# Altium schematic sheet FOTA.SchDoc
size A3
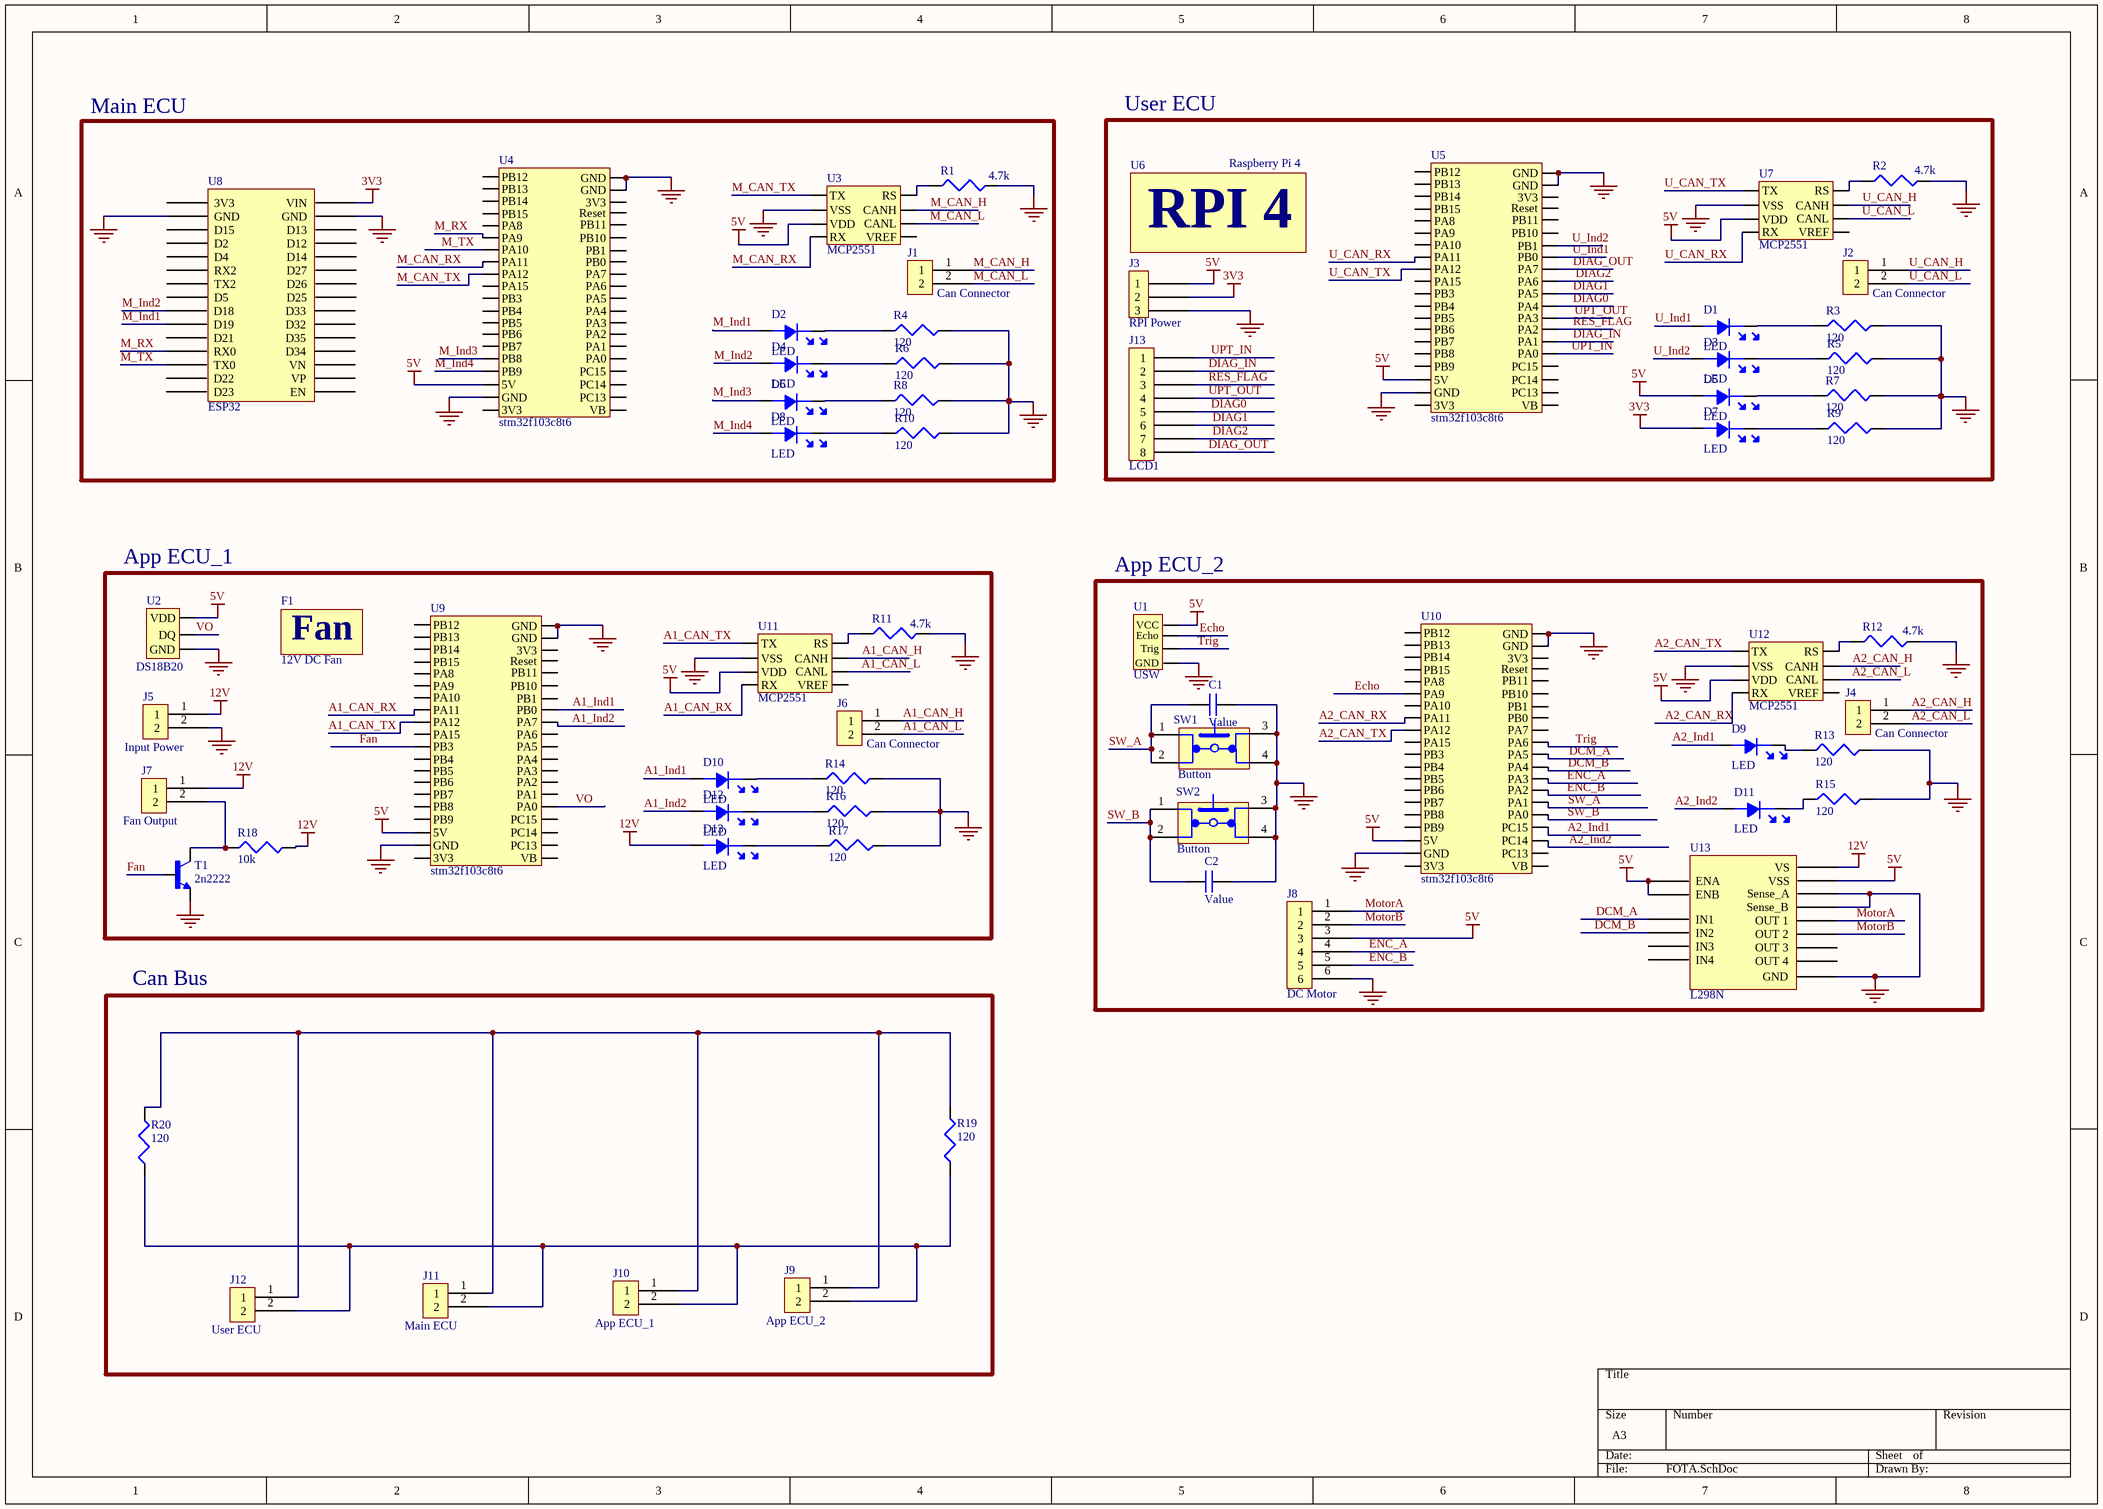
[diagram p0: FOTA.SchDoc]

## Parts
C1  Value  [CAP non]
C2  Value  [CAP non]
D1  LED  [LED]
D2  LED  [LED]
D3  LED  [LED]
D4  LED  [LED]
D5  LED  [LED]
D6  LED  [LED]
D7  LED  [LED]
D8  LED  [LED]
D9  LED  [LED]
D10  LED  [LED]
D11  LED  [LED]
D12  LED  [LED]
D13  LED  [LED]
F1  12V DC Fan
J1  Can Connector  [Data Connnector 2 pins]
J2  Can Connector  [Data Connnector 2 pins]
J3  RPI Power  [Data Connnector 3 pins]
J4  Can Connector  [Data Connnector 2 pins]
J5  Input Power  [Data Connnector 2 pins]
J6  Can Connector  [Data Connnector 2 pins]
J7  Fan Output  [Data Connnector 2 pins]
J8  DC Motor  [Data Connnector 6 pins]
J9  App ECU_2  [Data Connnector 2 pins]
J10  App ECU_1  [Data Connnector 2 pins]
J11  Main ECU  [Data Connnector 2 pins]
J12  User ECU  [Data Connnector 2 pins]
J13  LCD1  [Data Connector 8 pins]
R1  4.7k  [4.7k]
R2  4.7k  [4.7k]
R3  120  [R120]
R4  120  [R120]
R5  120  [R120]
R6  120  [R120]
R7  120  [R120]
R8  120  [R120]
R9  120  [R120]
R10  120  [R120]
R11  4.7k  [4.7k]
R12  4.7k  [4.7k]
R13  120  [R120]
R14  120  [R120]
R15  120  [R120]
R16  120  [R120]
R17  120  [R120]
R18  10k  [10k]
R19  120  [R120]
R20  120  [R120]
SW1  Button  [DIP4 SW]
SW2  Button  [DIP4 SW]
T1  2n2222  [TRANS]
U1  USW  [hc-sr04]
U2  DS18B20  [tmp]
U3  MCP2551  [MCP2551]
U4  stm32f103c8t6  [DIP46]
U5  stm32f103c8t6  [DIP46]
U6  Raspberry Pi 4  [RPI4]
U7  MCP2551  [MCP2551]
U8  ESP32  [ESP32]
U9  stm32f103c8t6  [DIP46]
U10  stm32f103c8t6  [DIP46]
U11  MCP2551  [MCP2551]
U12  MCP2551  [MCP2551]
U13  L298N  [L298]

## Blocks framed on the sheet
Main ECU: D2 D4 D6 D8 J1 R1 R4 R6 R8 R10 U3 U4 U8
User ECU: D1 D3 D5 D7 J2 J3 J13 R2 R3 R5 R7 R9 U5-U7
App ECU_1: D10 D12 D13 F1 J5-J7 R11 R14 R16-R18 T1 U2 U9 U11
App ECU_2: C1 C2 D9 D11 J4 J8 R12 R13 R15 SW1 SW2 U1 U10 U12 U13
Can Bus: J9-J12 R19 R20

## Nets
3V3: D7.1 J3.2 U8.30(VIN)
5V: D5.1 J3.1 J8.3 U1.1(VCC) U2.1(VDD) U3.3(VDD) U4.44(5V) U5.44(5V) U7.3(VDD) U9.44(5V) U10.44(5V) U11.3(VDD) U12.3(VDD) U13.9(ENB) U13.10(ENA) U13.13(VSS)
12V: D13.1 J5.1 J7.1 R18.1 U13.14(VS)
GND: C1.2 C2.2 J3.3 J5.2 J8.6 R1.1 R2.1 R3.1 R4.1 R5.1 R6.1 R7.1 R8.1 R9.1 R10.1 R11.1 R12.1 R13.1 R14.1 R15.1 R16.1 R17.1 SW1.3 SW1.4 SW2.3 SW2.4 T1.1(E) U1.4(GND) U2.3(GND) U3.2(VSS) U4.19(GND) U4.20(GND) U4.45(GND) U5.19(GND) U5.20(GND) U5.45(GND) U7.2(VSS) U8.2(GND) U8.29(GND) U9.19(GND) U9.20(GND) U9.45(GND) U10.19(GND) U10.20(GND) U10.45(GND) U11.2(VSS) U12.2(VSS) U13.11(Sense_B) U13.12(Sense_A) U13.15(GND)
A1_CAN_H: J6.1 U11.7(CANH)
A1_CAN_L: J6.2 U11.6(CANL)
A1_CAN_RX: U9.34(PA11) U11.4(RX)
A1_CAN_TX: U9.35(PA12) U11.1(TX)
A1_Ind1: D10.1 U9.13(PB0)
A1_Ind2: D12.1 U9.12(PA7)
A2_CAN_H: J4.1 U12.7(CANH)
A2_CAN_L: J4.2 U12.6(CANL)
A2_CAN_RX: U10.34(PA11) U12.4(RX)
A2_CAN_TX: U10.35(PA12) U12.1(TX)
A2_Ind1: D9.1 U10.4(PC15)
A2_Ind2: D11.1 U10.3(PC14)
DCM_A: U10.10(PA5) U13.8(IN1)
DCM_B: U10.9(PA4) U13.7(IN2)
DIAG0: J13.5 U5.9(PA4)
DIAG1: J13.6 U5.10(PA5)
DIAG2: J13.7 U5.11(PA6)
DIAG_IN: J13.2 U5.6(PA1)
DIAG_OUT: J13.8 U5.12(PA7)
Echo: U1.3(Echo) U10.32(PA9)
ENC_A: J8.4 U10.8(PA3)
ENC_B: J8.5 U10.7(PA2)
Fan: T1.2(B) U9.37(PB3)
M_CAN_H: J1.1 U3.7(CANH)
M_CAN_L: J1.2 U3.6(CANL)
M_CAN_RX: U3.4(RX) U4.34(PA11)
M_CAN_TX: U3.1(TX) U4.35(PA12)
M_Ind1: D2.1 U8.10(D19)
M_Ind2: D4.1 U8.9(D18)
M_Ind3: D6.1 U4.42(PB8)
M_Ind4: D8.1 U4.43(PB9)
M_RX: U4.32(PA9) U8.12(RX0)
M_TX: U4.33(PA10) U8.13(TX0)
MotorA: J8.1 U13.4(OUT_1)
MotorB: J8.2 U13.3(OUT_2)
RES_FLAG: J13.3 U5.7(PA2)
SW_A: C1.1 SW1.1 SW1.2 U10.6(PA1)
SW_B: C2.1 SW2.1 SW2.2 U10.5(PA0)
Trig: U1.2(Trig) U10.11(PA6)
U_CAN_H: J2.1 U7.7(CANH)
U_CAN_L: J2.2 U7.6(CANL)
U_CAN_RX: U5.34(PA11) U7.4(RX)
U_CAN_TX: U5.35(PA12) U7.1(TX)
U_Ind1: D1.1 U5.13(PB0)
U_Ind2: D3.1 U5.14(PB1)
UPT_IN: J13.1 U5.5(PA0)
UPT_OUT: J13.4 U5.8(PA3)
VO: U2.2(DQ) U9.5(PA0)
NetD1_2: D1.2 R3.2
NetD2_2: D2.2 R4.2
NetD3_2: D3.2 R5.2
NetD4_2: D4.2 R6.2
NetD5_2: D5.2 R7.2
NetD6_2: D6.2 R8.2
NetD7_2: D7.2 R9.2
NetD8_2: D8.2 R10.2
NetD9_2: D9.2 R13.2
NetD10_2: D10.2 R14.2
NetD11_2: D11.2 R15.2
NetD12_2: D12.2 R16.2
NetD13_2: D13.2 R17.2
NetJ7_2: J7.2 R18.2 T1.3(C)
NetJ9_1: J9.1 J10.1 J11.1 J12.1 R19.1 R20.1
NetJ9_2: J9.2 J10.2 J11.2 J12.2 R19.2 R20.2
NetR1_2: R1.2 U3.8(RS)
NetR2_2: R2.2 U7.8(RS)
NetR11_2: R11.2 U11.8(RS)
NetR12_2: R12.2 U12.8(RS)

Not connected (* = marked no-connect by the designer): U3 5(VREF); U4 1(VB) 2(PC13) 3(PC14) 4(PC15) 5(PA0) 6(PA1) 7(PA2) 8(PA3) 9(PA4) 10(PA5) 11(PA6) 12(PA7) 13(PB0) 14(PB1) 15(PB10) 16(PB11) 17(Reset) 18(3V3) 27(PB12) 28(PB13) 29(PB14) 30(PB15) 31(PA8) 36(PA15) 37(PB3) 38(PB4) 39(PB5) 40(PB6) 41(PB7) 46(3V3); U5 1(VB) 2(PC13) 3(PC14) 4(PC15) 15(PB10) 16(PB11) 17(Reset) 18(3V3) 27(PB12) 28(PB13) 29(PB14) 30(PB15) 31(PA8) 32(PA9) 33(PA10) 36(PA15) 37(PB3) 38(PB4) 39(PB5) 40(PB6) 41(PB7) 42(PB8) 43(PB9) 46(3V3); U7 5(VREF); U8 1(3V3) 3(D15) 4(D2) 5(D4) 6(RX2) 7(TX2) 8(D5) 11(D21) 14(D22) 15(D23) 16(EN) 17(VP) 18(VN) 19(D34) 20(D35) 21(D32) 22(D33) 23(D25) 24(D26) 25(D27) 26(D14) 27(D12) 28(D13); U9 1(VB) 2(PC13) 3(PC14) 4(PC15) 6(PA1) 7(PA2) 8(PA3) 9(PA4) 10(PA5) 11(PA6) 14(PB1) 15(PB10) 16(PB11) 17(Reset) 18(3V3) 27(PB12) 28(PB13) 29(PB14) 30(PB15) 31(PA8) 32(PA9) 33(PA10) 36(PA15) 38(PB4) 39(PB5) 40(PB6) 41(PB7) 42(PB8) 43(PB9) 46(3V3); U10 1(VB) 2(PC13) 12(PA7) 13(PB0) 14(PB1) 15(PB10) 16(PB11) 17(Reset) 18(3V3) 27(PB12) 28(PB13) 29(PB14) 30(PB15) 31(PA8) 33(PA10) 36(PA15) 37(PB3) 38(PB4) 39(PB5) 40(PB6) 41(PB7) 42(PB8) 43(PB9) 46(3V3); U11 5(VREF); U12 5(VREF); U13 1(OUT_4) 2(OUT_3) 5(IN4) 6(IN3)

## Notes on the sheet
- (in symbol Raspberry Pi 4) RPI 4

## Library data of the parts
C1 C2 = Non polarized capacitor: Generial Non polarized capacitor for through hole or SMD capacitors
D1-D13 = LED: Led, Red, T-1 (3Mm), 630 Nm, 1.8 V, 30 Ma, 20 Mcd Rohs Compliant: Yes; Manufacturer 1: Wurth Electronics; Manufacturer Part Number 1: 151031SS06000; Wavelength: 630nm; Luminous Intensity: 35mcd; Viewing Angle: 60°; Forward Voltage: 2.2V; Lens Style: Diffused,Circular,Round; Dominant Wavelength: 640nm; Test Current: 20mA; Forward Current: 30mA; Supplier 1: Digi-Key; Stock 1: 4849; Pricing 1: 1=0.18000, 50=0.16700, 100=0.14300, 500=0.12300 (USD); RoHS: Yes; Mount: Through Hole; Case/Package: Radial; Color: Red; Min Operating Temperature: -40°C; Max Operating Temperature: 85°C; Package Quantity: 1; Packaging: Bulk; Height: 5.55mm; Lens Size: 3mm; REACH SVHC: Unknown; RoHS Compliant: Yes; ComponentLink1URL: https://datasheet.ciiva.com/22657/151031ss06000-22657010.pdf?src-supplier=Element14; ComponentLink1Description: https://datasheet.ciiva.com/22657/151031ss06000-22657010.pdf?src-supplier=Element14; ComponentLink2URL: https://datasheet.ciiva.com/29335/759483-da-01-en-tht-led-3mm-superrot-151031ss06000-29335440.pdf?src-supplier=Conrad; ComponentLink2Description: https://datasheet.ciiva.com/29335/759483-da-01-en-tht-led-3mm-superrot-151031ss06000-29335440.pdf?src-supplier=Conrad; ComponentLink3URL: https://datasheet.ciiva.com/29562/151031ss06000-29562907.pdf?src-supplier=Digi-Key; ComponentLink3Description: https://datasheet.ciiva.com/29562/151031ss06000-29562907.pdf?src-supplier=Digi-Key; Supplier Part Number 1: 732-5006-ND; Category: Optoelectronics
F1 = Fan
J1 J2 J4-J7 J9-J12 = Data Connector 2 pins
J3 = Data Connector 3 pin
J8 = Data Connector 6 pin
J13 = Data Connector 8 pins
R1 R2 R11 R12 = R 4K7: Res Carbon Film 4.7K Ohm 5% 1/4W -500ppm/°C to 350ppm/°C Conformal AXL Thru-Hole Paper T/R; Manufacturer 1: Yageo; Manufacturer Part Number 1: CFR-25JR-52-4K7; Resistance: 4.7kR; Max Power Dissipation: 250mW; Voltage Rating: 250V; Lead Diameter: 0.55mm; Supplier 1: Digi-Key; Stock 1: 115000; Pricing 1: 5000=0.00884, 10000=0.00793, 25000=0.00728, 50000=0.00684, 125000=0.00668 (USD); RoHS: Yes; Mount: Through Hole; Case/Package: Axial; Contact Plating: Tin,Matte; Min Operating Temperature: -55°C; Max Operating Temperature: 155°C; Tolerance: 5%; Packaging: Tape and Reel; Package Quantity: 5000; Resistor Type: Carbon Film; Temperature Coefficient: 350ppm/°C; Number of Terminations: 2; Series: CFR; Power Rating: 250mW; Termination: Axial; Diameter: 2.4mm; Length: 6.3mm; Radiation Hardening: No; RoHS Compliant: Yes; Lead Free: Lead Free; ComponentLink1URL: http://www.mouser.com/ds/2/447/Yageo%20LR_CFR_2013-540723.pdf?src-supplier=Mouser; ComponentLink1Description: http://www.mouser.com/ds/2/447/Yageo%20LR_CFR_2013-540723.pdf?src-supplier=Mouser; ComponentLink2URL: http://www.yageo.com/NewPortal/yageodocoutput?fileName=/pdf/throughhole/Yageo_LR_CFR_2013.pdf&src-supplier=Digi-Key; ComponentLink2Description: http://www.yageo.com/NewPortal/yageodocoutput?fileName=/pdf/throughhole/Yageo_LR_CFR_2013.pdf&src-supplier=Digi-Key; ComponentLink3URL: http://www.yageo.com/documents/recent/General%20Type_CFR.pdf?src-supplier=Future+Electronics; ComponentLink3Description: http://www.yageo.com/documents/recent/General%20Type_CFR.pdf?src-supplier=Future+Electronics; ComponentLink4URL: http://www.yageo.com/documents/recent/Yageo%20LR_CFR_2013.pdf?src-supplier=Avnet; ComponentLink4Description: http://www.yageo.com/documents/recent/Yageo%20LR_CFR_2013.pdf?src-supplier=Avnet; Supplier Part Number 1: 4.7KQTR-ND; Category: Resistors
R3-R10 R13-R17 = R120: General Type Carbon Film Resistor 120Ohm 1/4W 5% Axial Bulk; Manufacturer 1: Yageo; Manufacturer Part Number 1: CFR-25JB-52-120R; Resistance: 120R; Power Rating: 250mW; Temperature Coefficient: 500ppm/°C; Supplier 1: Future Electronics; Stock 1: 7000; Pricing 1: 10000=0.00860, 30000=0.00580, 50000=0.00570, 100000=0.00550, 200000=0.00540 (USD); RoHS: Yes; Case/Package: Axial; Min Operating Temperature: -55°C; Max Operating Temperature: 155°C; Tolerance: 5%; Package Quantity: 200; Packaging: Bulk; Resistor Type: Carbon Film; Number of Terminations: 2; Max Power Dissipation: 250mW; Series: Carbon Film; Length: 0.248inch; Lead Free: Lead Free; RoHS Compliant: Yes; ComponentLink1URL: http://www.yageo.com/documents/recent/General%20Type_CFR.pdf?src-supplier=Future+Electronics; ComponentLink1Description: http://www.yageo.com/documents/recent/General%20Type_CFR.pdf?src-supplier=Future+Electronics; ComponentLink2URL: http://www.yageo.com/NewPortal/yageodocoutput?fileName=/pdf/throughhole/Yageo_LR_CFR_2013.pdf&src-supplier=Digi-Key; ComponentLink2Description: http://www.yageo.com/NewPortal/yageodocoutput?fileName=/pdf/throughhole/Yageo_LR_CFR_2013.pdf&src-supplier=Digi-Key; Supplier Part Number 1: 9005903
R18 = R 10K: Through Hole Carbon Film Resistor, Cfr Series, 10 Kohm, 250 Mw, - 5%, 200 V, Axial Leaded; Manufacturer 1: TE Connectivity; Manufacturer Part Number 1: CFR16J10K; Supplier 1: Avnet; Stock 1: 10000; Pricing 1: 10000=0.00819 (USD); RoHS: Yes; ComponentLink1URL: https://datasheet.ciiva.com/11823/0900766b80098b49-11823186.pdf?src-supplier=RSComponents; ComponentLink1Description: https://datasheet.ciiva.com/11823/0900766b80098b49-11823186.pdf?src-supplier=RSComponents; ComponentLink2URL: https://datasheet.ciiva.com/12362/eng-ds-1773195-d-12362991.pdf?src-supplier=Mouser; ComponentLink2Description: https://datasheet.ciiva.com/12362/eng-ds-1773195-d-12362991.pdf?src-supplier=Mouser; Supplier Part Number 1: 1623927-4
R19 R20 = R120_TH
SW1 SW2 = Push Button
U1 = HC-SR04: Ultrasonic Sensor Module, Rectangular, 20-4000 mm, 5 V, 15 mA, Arduino Compatible; Manufacturer 1: OSEPP; Supplier 1: Mouser; Manufacturer Part Number 1: HC-SR04; Stock 1: 154; Pricing 1: 1=6.55000, 10=6.55000, 50=6.55000, 100=6.55000, 1000=6.55000, 10000=6.55000 (USD); ComponentLink1URL: http://www.alliedelec.com/m/d/24ef524bf2e055bb41c3e7d4403161f4.pdf?src-supplier=Allied+Electronics; ComponentLink1Description: http://www.alliedelec.com/m/d/24ef524bf2e055bb41c3e7d4403161f4.pdf?src-supplier=Allied+Electronics; ComponentLink2URL: https://datasheet.octopart.com/HC-SR04-OSEPP-datasheet-46721640.pdf?src-supplier=Allied+Electronics; ComponentLink2Description: https://datasheet.octopart.com/HC-SR04-OSEPP-datasheet-46721640.pdf?src-supplier=Allied+Electronics; Supplier Part Number 1: 375-HC-SR04; Category: Development Boards, Kits, Programmers
U2 = DS18B20: SENSOR TEMPERATURE 1-WIRE TO92-3; Manufacturer 1: Maxim; Manufacturer Part Number 1: DS18B20+; Min Supply Voltage: 3V; Max Supply Voltage: 5.5V; Interface: 1-WIRE,Serial; Resolution: 12b; Output Type: Digital,Voltage; Operating Supply Current: 1.5mA; Number of Bits: 12; Nominal Supply Current: 1mA; Output Current: 4mA; Supplier 1: Future Electronics; Stock 1: 0; Pricing 1: 1=5.05000, 10=4.56000, 25=4.38000, 75=4.17000, 150=4.04000 (USD); RoHS: Yes; Mount: PCB,Through Hole; Case/Package: TO-92-3; Number of Pins: 3; Weight: 0.001lb; Min Operating Temperature: -55°C; Max Operating Temperature: 125°C; Packaging: Rail/Tube; Package Quantity: 10; Series: DS18B20; Max Supply Voltage (DC): 5.5V; Min Supply Voltage (DC): 3V; Termination: SMD/SMT; Supply Current: 1mA; Sensor Type: Temperature; Length: 4.95mm; Width: 3.94mm; Height: 4.95mm; Radiation Hardening: No; RoHS Compliant: Yes; REACH SVHC: No SVHC; Lead Free: Lead Free; ComponentLink1URL: https://datasheet.ciiva.com/14100/ds18b20-eng-tds-14100018.pdf?src-supplier=Distrelec; ComponentLink1Description: https://datasheet.ciiva.com/14100/ds18b20-eng-tds-14100018.pdf?src-supplier=Distrelec; ComponentLink2URL: https://datasheet.ciiva.com/19456/865936-19456316.pdf?src-supplier=Jameco; ComponentLink2Description: https://datasheet.ciiva.com/19456/865936-19456316.pdf?src-supplier=Jameco; ComponentLink3URL: https://datasheet.ciiva.com/23809/46379-23809287.pdf?src-supplier=Newark; ComponentLink3Description: https://datasheet.ciiva.com/23809/46379-23809287.pdf?src-supplier=Newark; ComponentLink4URL: https://datasheet.ciiva.com/5696/ds18s20-5696782.pdf?src-supplier=Farnell; ComponentLink4Description: https://datasheet.ciiva.com/5696/ds18s20-5696782.pdf?src-supplier=Farnell; ComponentLink5URL: https://datasheet.ciiva.com/3277/ds18b20-3277869.pdf?src-supplier=Avnet; ComponentLink5Description: https://datasheet.ciiva.com/3277/ds18b20-3277869.pdf?src-supplier=Avnet; ComponentLink6URL: https://datasheet.ciiva.com/2003/ds18b20-2003437.pdf?src-supplier=Digi-Key; ComponentLink6Description: https://datasheet.ciiva.com/2003/ds18b20-2003437.pdf?src-supplier=Digi-Key; Supplier Part Number 1: 6084674
U3 U7 U11 U12 = MCP2551-I/P: MCP2551 Series 5.5 V 1 Mb/s Surface Mount High-Speed CAN Transceiver - PDIP-8; Manufacturer 1: Microchip; Interface: Serial,CAN; Number of Receivers: 1; Operating Supply Voltage: 5V; Nominal Supply Current: 75mA; Data Rate: 1Mbps; Min Supply Voltage: 4.5V; Max Supply Voltage: 5.5V; Supplier 1: Future Electronics; Manufacturer Part Number 1: MCP2551-I/P; Stock 1: 570; Pricing 1: 1=1.75000, 30=1.57000, 100=1.51000, 300=1.46000, 1000=1.40000 (USD); RoHS: Yes; Mount: Through Hole; Case/Package: PDIP; Number of Pins: 8; Min Operating Temperature: -40°C; Max Operating Temperature: 85°C; Package Quantity: 60; Packaging: Rail/Tube; Number of Drivers: 1; Number of Receive Buffers: 1; Number of Transmit Buffers: 1; Max Supply Current: 75mA; Number of Transceivers: 1; Logic Function: Transceiver; Number of Functions: 1; Supply Voltage-Nom: 5.5V; Supply Current: 75mA; Length: 9.27mm; Width: 6.35mm; Height: 3.3mm; Radiation Hardening: No; REACH SVHC: No SVHC; Lead Free: Lead Free; RoHS Compliant: Yes; ComponentLink1URL: https://datasheet.ciiva.com/14152/eb644223-644224-e-14152538.pdf?src-supplier=Distrelec; ComponentLink1Description: https://datasheet.ciiva.com/14152/eb644223-644224-e-14152538.pdf?src-supplier=Distrelec; ComponentLink2URL: https://datasheet.ciiva.com/1495/21667f-1495088.pdf?src-supplier=Element14; ComponentLink2Description: https://datasheet.ciiva.com/1495/21667f-1495088.pdf?src-supplier=Element14; ComponentLink3URL: https://datasheet.ciiva.com/18405/70045401-18405559.pdf?src-supplier=Allied+Electronics; ComponentLink3Description: https://datasheet.ciiva.com/18405/70045401-18405559.pdf?src-supplier=Allied+Electronics; ComponentLink4URL: https://datasheet.ciiva.com/8084/21667f-8084591.pdf?src-supplier=Avnet; ComponentLink4Description: https://datasheet.ciiva.com/8084/21667f-8084591.pdf?src-supplier=Avnet; ComponentLink5URL: https://datasheet.ciiva.com/16381/filehandler-aspxddocname-en011797-16381270.pdf?src-supplier=Future+Electronics; ComponentLink5Description: https://datasheet.ciiva.com/16381/filehandler-aspxddocname-en011797-16381270.pdf?src-supplier=Future+Electronics; ComponentLink6URL: https://datasheet.ciiva.com/1700/21667f-1700024.pdf?src-supplier=Digi-Key; ComponentLink6Description: https://datasheet.ciiva.com/1700/21667f-1700024.pdf?src-supplier=Digi-Key; ComponentLink7URL: https://datasheet.ciiva.com/29305/651451-da-01-en-ic-tx-can-mcp2551-i-p-pdip-8-mcp-29305164.pdf?src-supplier=Conrad; ComponentLink7Description: https://datasheet.ciiva.com/29305/651451-da-01-en-ic-tx-can-mcp2551-i-p-pdip-8-mcp-29305164.pdf?src-supplier=Conrad; Supplier Part Number 1: 6665723; Category: Integrated Circuits (ICs)
U4 U5 U9 U10 = stm32f103c8t6: STM32 Nucleo-32 development board with STM32F031K6 MCU, supports Arduino connectivity; Manufacturer 1: STMicroelectronics; Manufacturer Part Number 1: NUCLEO-F031K6; Evaluation Kit: Yes; Number of Bits: 32; Core Architecture: ARM; Supplier 1: Avnet; Stock 1: 0; Pricing 1: 61=15.28100, 70=14.45500, 130=13.62900, 310=12.80300, 610=11.97700, 3100=11.15100, 6100=10.32500 (USD); RoHS: Yes; Package Quantity: 1; Lead Free: Lead Free; REACH SVHC: No SVHC; ComponentLink1URL: http://www.farnell.com/datasheets/1966773.pdf?src-supplier=Farnell; ComponentLink1Description: http://www.farnell.com/datasheets/1966773.pdf?src-supplier=Farnell; ComponentLink2URL: http://www.farnell.com/datasheets/1966773.pdf?src-supplier=Element14; ComponentLink2Description: http://www.farnell.com/datasheets/1966773.pdf?src-supplier=Element14; ComponentLink3URL: http://www.st.com/st-web-ui/static/active/en/resource/technical/document/user_manual/DM00119724.pdf?s_searchtype=keyword&src-supplier=Avnet; ComponentLink3Description: http://www.st.com/st-web-ui/static/active/en/resource/technical/document/user_manual/DM00119724.pdf?s_searchtype=keyword&src-supplier=Avnet; ComponentLink4URL: http://www.st.com/content/ccc/resource/technical/document/datasheet/4d/c2/7e/10/77/4f/4a/60/DM00104043.pdf/files/DM00104043.pdf/jcr:content/translations/en.DM00104043.pdf?src-supplier=Digi-Key; ComponentLink4Description: http://www.st.com/content/ccc/resource/technical/document/datasheet/4d/c2/7e/10/77/4f/4a/60/DM00104043.pdf/files/DM00104043.pdf/jcr:content/translations/en.DM00104043.pdf?src-supplier=Digi-Key; Supplier Part Number 1: NUCLEO-F031K6; Category: Development Boards, Kits, Programmers
U13 = L298N Breakout